# Altium schematic sheet MT8365_Power.SchDoc
size A3; SheetNumber: 3; SheetTotal: 36
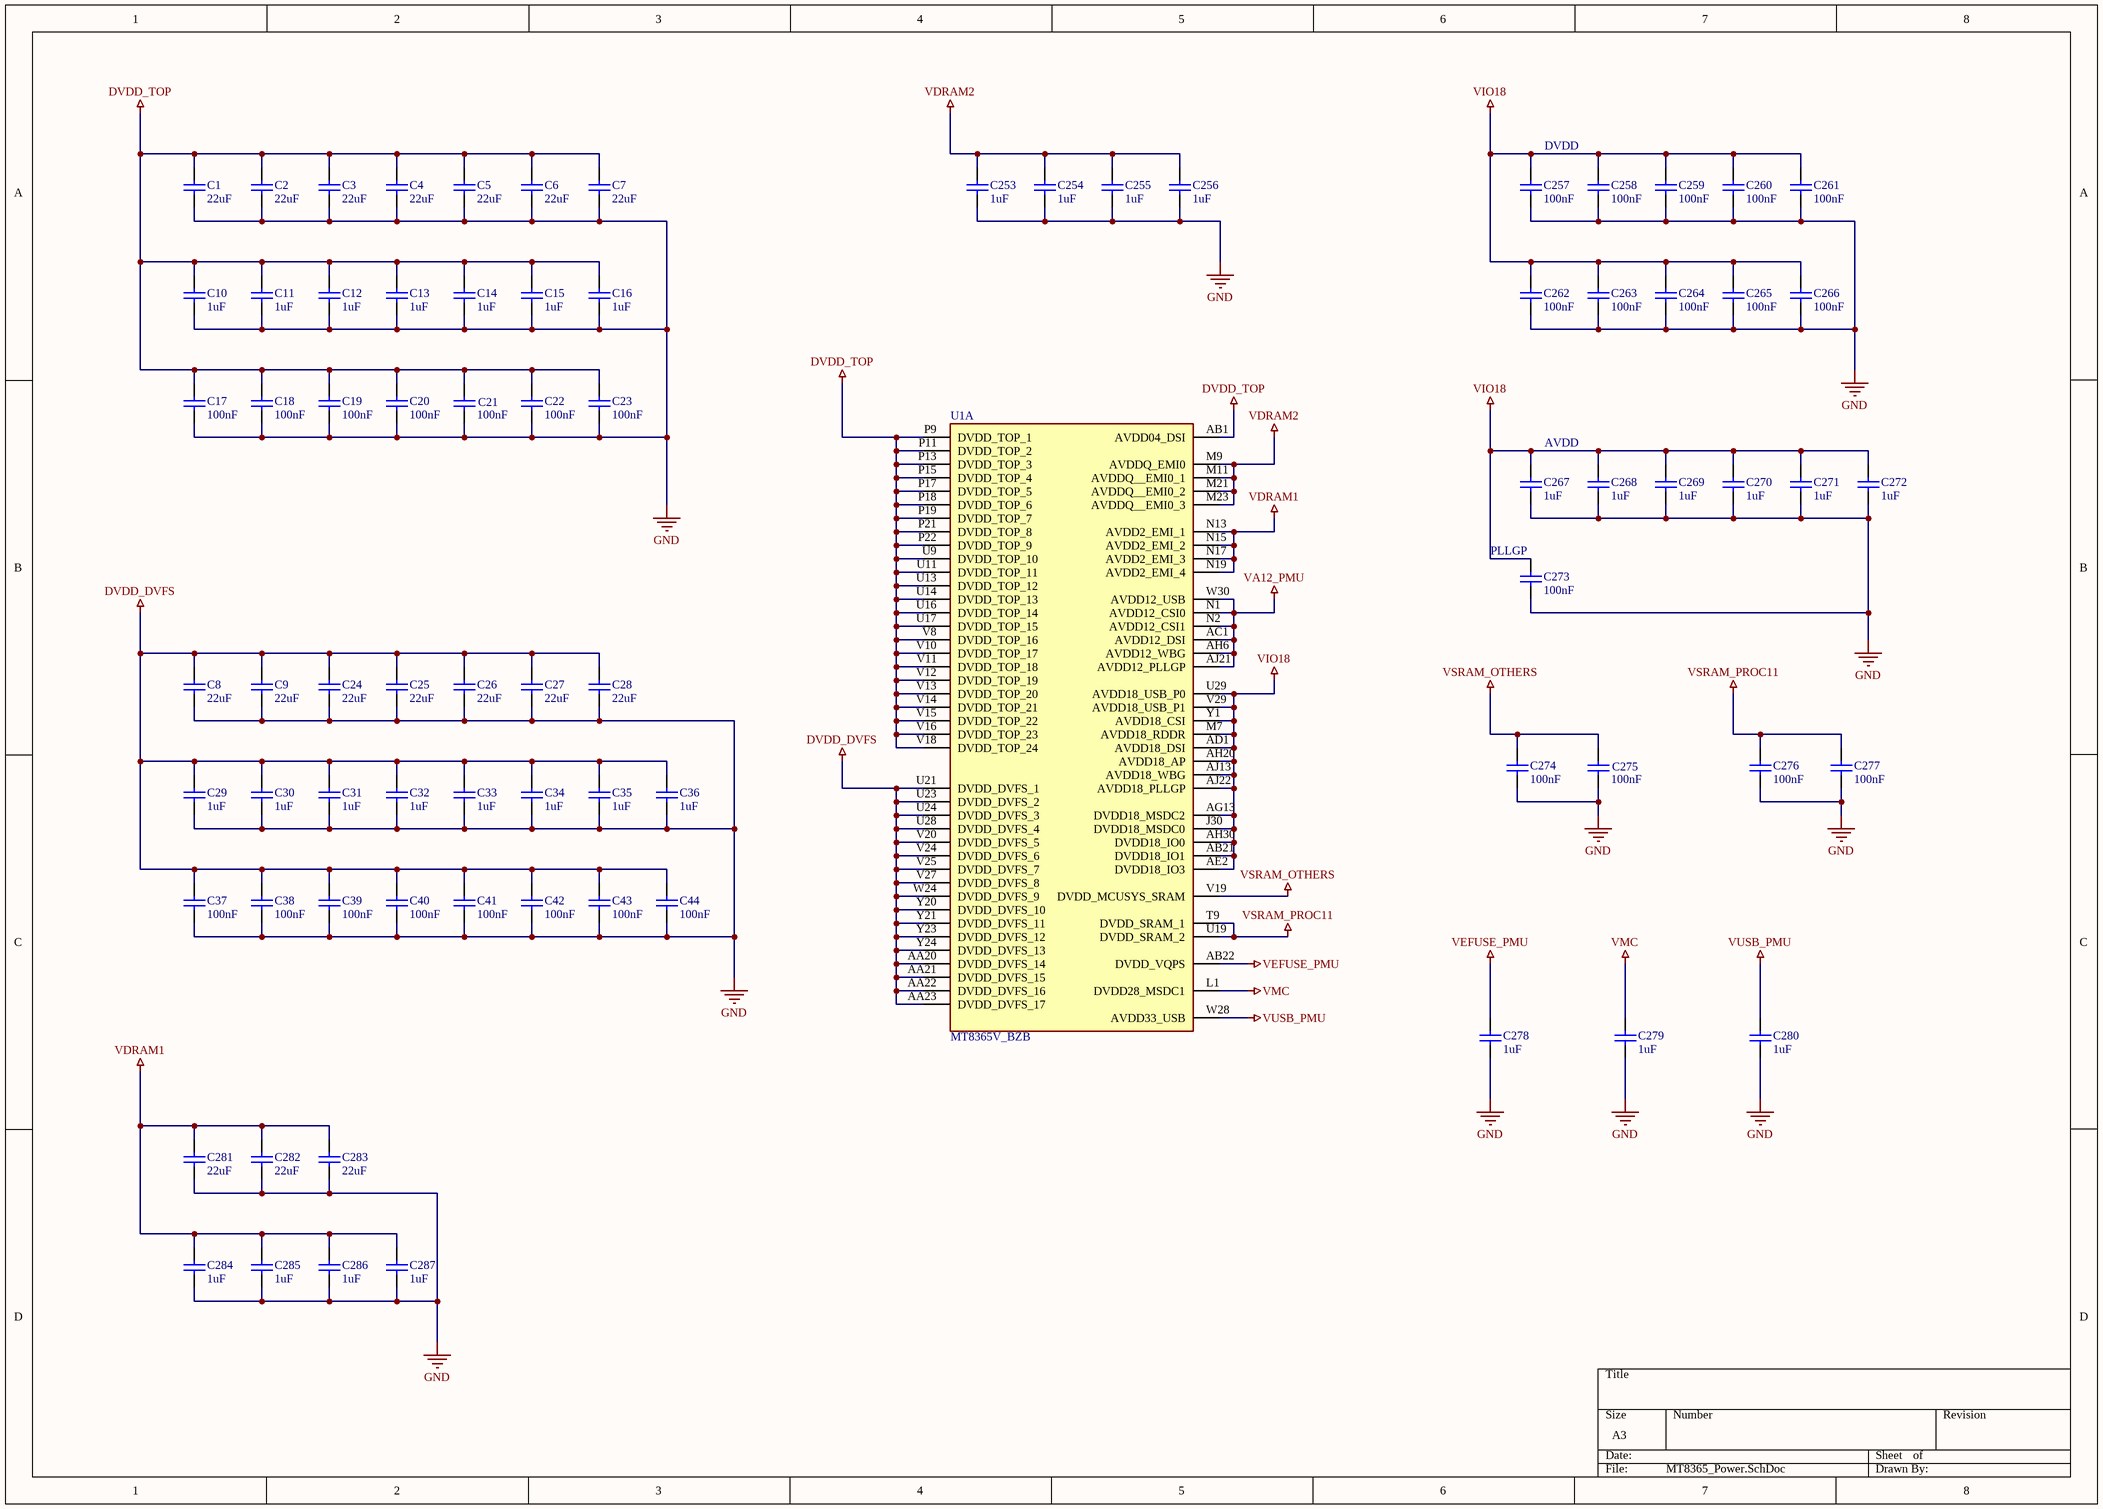
[diagram p0: MT8365_Power.SchDoc]

## Parts
C1  value 22uF  [C1210]  (hidden comment: C1210)
C2  value 22uF  [C1210]  (hidden comment: C1210)
C3  value 22uF  [C1210]  (hidden comment: C1210)
C4  value 22uF  [C1210]  (hidden comment: C1210)
C5  value 22uF  [C1210]  (hidden comment: C1210)
C6  value 22uF  [C1210]  (hidden comment: C1210)
C7  value 22uF  [C1210]  (hidden comment: C1210)
C8  value 22uF  [C1210]  (hidden comment: C1210)
C9  value 22uF  [C1210]  (hidden comment: C1210)
C10  value 1uF  [C0805]  (hidden comment: C0805)
C11  value 1uF  [C0805]  (hidden comment: C0805)
C12  value 1uF  [C0805]  (hidden comment: C0805)
C13  value 1uF  [C0805]  (hidden comment: C0805)
C14  value 1uF  [C0805]  (hidden comment: C0805)
C15  value 1uF  [C0805]  (hidden comment: C0805)
C16  value 1uF  [C0805]  (hidden comment: C0805)
C17  value 100nF  [C0603]  (hidden comment: C0603)
C18  value 100nF  [C0603]  (hidden comment: C0603)
C19  value 100nF  [C0603]  (hidden comment: C0603)
C20  value 100nF  [C0603]  (hidden comment: C0603)
C21  value 100nF  [C0603]  (hidden comment: C0603)
C22  value 100nF  [C0603]  (hidden comment: C0603)
C23  value 100nF  [C0603]  (hidden comment: C0603)
C24  value 22uF  [C1210]  (hidden comment: C1210)
C25  value 22uF  [C1210]  (hidden comment: C1210)
C26  value 22uF  [C1210]  (hidden comment: C1210)
C27  value 22uF  [C1210]  (hidden comment: C1210)
C28  value 22uF  [C1210]  (hidden comment: C1210)
C29  value 1uF  [C0805]  (hidden comment: C0805)
C30  value 1uF  [C0805]  (hidden comment: C0805)
C31  value 1uF  [C0805]  (hidden comment: C0805)
C32  value 1uF  [C0805]  (hidden comment: C0805)
C33  value 1uF  [C0805]  (hidden comment: C0805)
C34  value 1uF  [C0805]  (hidden comment: C0805)
C35  value 1uF  [C0805]  (hidden comment: C0805)
C36  value 1uF  [C0805]  (hidden comment: C0805)
C37  value 100nF  [C0603]  (hidden comment: C0603)
C38  value 100nF  [C0603]  (hidden comment: C0603)
C39  value 100nF  [C0603]  (hidden comment: C0603)
C40  value 100nF  [C0603]  (hidden comment: C0603)
C41  value 100nF  [C0603]  (hidden comment: C0603)
C42  value 100nF  [C0603]  (hidden comment: C0603)
C43  value 100nF  [C0603]  (hidden comment: C0603)
C44  value 100nF  [C0603]  (hidden comment: C0603)
C253  value 1uF  [C0805]  (hidden comment: C0805)
C254  value 1uF  [C0805]  (hidden comment: C0805)
C255  value 1uF  [C0805]  (hidden comment: C0805)
C256  value 1uF  [C0805]  (hidden comment: C0805)
C257  value 100nF  [C0603]  (hidden comment: C0603)
C258  value 100nF  [C0603]  (hidden comment: C0603)
C259  value 100nF  [C0603]  (hidden comment: C0603)
C260  value 100nF  [C0603]  (hidden comment: C0603)
C261  value 100nF  [C0603]  (hidden comment: C0603)
C262  value 100nF  [C0603]  (hidden comment: C0603)
C263  value 100nF  [C0603]  (hidden comment: C0603)
C264  value 100nF  [C0603]  (hidden comment: C0603)
C265  value 100nF  [C0603]  (hidden comment: C0603)
C266  value 100nF  [C0603]  (hidden comment: C0603)
C267  value 1uF  [C0805]  (hidden comment: C0805)
C268  value 1uF  [C0805]  (hidden comment: C0805)
C269  value 1uF  [C0805]  (hidden comment: C0805)
C270  value 1uF  [C0805]  (hidden comment: C0805)
C271  value 1uF  [C0805]  (hidden comment: C0805)
C272  value 1uF  [C0805]  (hidden comment: C0805)
C273  value 100nF  [C0603]  (hidden comment: C0603)
C274  value 100nF  [C0603]  (hidden comment: C0603)
C275  value 100nF  [C0603]  (hidden comment: C0603)
C276  value 100nF  [C0603]  (hidden comment: C0603)
C277  value 100nF  [C0603]  (hidden comment: C0603)
C278  value 1uF  [C0805]  (hidden comment: C0805)
C279  value 1uF  [C0805]  (hidden comment: C0805)
C280  value 1uF  [C0805]  (hidden comment: C0805)
C281  value 22uF  [C1210]  (hidden comment: C1210)
C282  value 22uF  [C1210]  (hidden comment: C1210)
C283  value 22uF  [C1210]  (hidden comment: C1210)
C284  value 1uF  [C0805]  (hidden comment: C0805)
C285  value 1uF  [C0805]  (hidden comment: C0805)
C286  value 1uF  [C0805]  (hidden comment: C0805)
C287  value 1uF  [C0805]  (hidden comment: C0805)
U1  MT8365V_BZB  [BGA633C40P30X29_1220X1180X90]  (part A of 10)

## Nets
DVDD_DVFS: C8.2 C9.2 C24.2 C25.2 C26.2 C27.2 C28.2 C29.2 C30.2 C31.2 C32.2 C33.2 C34.2 C35.2 C36.2 C37.2 C38.2 C39.2 C40.2 C41.2 C42.2 C43.2 C44.2 U1.AA20(DVDD_DVFS_14) U1.AA21(DVDD_DVFS_15) U1.AA22(DVDD_DVFS_16) U1.AA23(DVDD_DVFS_17) U1.U21(DVDD_DVFS_1) U1.U23(DVDD_DVFS_2) U1.U24(DVDD_DVFS_3) U1.U28(DVDD_DVFS_4) U1.V20(DVDD_DVFS_5) U1.V24(DVDD_DVFS_6) U1.V25(DVDD_DVFS_7) U1.V27(DVDD_DVFS_8) U1.W24(DVDD_DVFS_9) U1.Y20(DVDD_DVFS_10) U1.Y21(DVDD_DVFS_11) U1.Y23(DVDD_DVFS_12) U1.Y24(DVDD_DVFS_13)
DVDD_TOP: C1.2 C2.2 C3.2 C4.2 C5.2 C6.2 C7.2 C10.2 C11.2 C12.2 C13.2 C14.2 C15.2 C16.2 C17.2 C18.2 C19.2 C20.2 C21.2 C22.2 C23.2 U1.AB1(AVDD04_DSI) U1.P9(DVDD_TOP_1) U1.P11(DVDD_TOP_2) U1.P13(DVDD_TOP_3) U1.P15(DVDD_TOP_4) U1.P17(DVDD_TOP_5) U1.P18(DVDD_TOP_6) U1.P19(DVDD_TOP_7) U1.P21(DVDD_TOP_8) U1.P22(DVDD_TOP_9) U1.U9(DVDD_TOP_10) U1.U11(DVDD_TOP_11) U1.U13(DVDD_TOP_12) U1.U14(DVDD_TOP_13) U1.U16(DVDD_TOP_14) U1.U17(DVDD_TOP_15) U1.V8(DVDD_TOP_16) U1.V10(DVDD_TOP_17) U1.V11(DVDD_TOP_18) U1.V12(DVDD_TOP_19) U1.V13(DVDD_TOP_20) U1.V14(DVDD_TOP_21) U1.V15(DVDD_TOP_22) U1.V16(DVDD_TOP_23) U1.V18(DVDD_TOP_24)
GND: C1.1 C2.1 C3.1 C4.1 C5.1 C6.1 C7.1 C8.1 C9.1 C10.1 C11.1 C12.1 C13.1 C14.1 C15.1 C16.1 C17.1 C18.1 C19.1 C20.1 C21.1 C22.1 C23.1 C24.1 C25.1 C26.1 C27.1 C28.1 C29.1 C30.1 C31.1 C32.1 C33.1 C34.1 C35.1 C36.1 C37.1 C38.1 C39.1 C40.1 C41.1 C42.1 C43.1 C44.1 C253.1 C254.1 C255.1 C256.1 C257.1 C258.1 C259.1 C260.1 C261.1 C262.1 C263.1 C264.1 C265.1 C266.1 C267.1 C268.1 C269.1 C270.1 C271.1 C272.1 C273.1 C274.1 C275.1 C276.1 C277.1 C278.1 C279.1 C280.1 C281.1 C282.1 C283.1 C284.1 C285.1 C286.1 C287.1
VA12_PMU: U1.AC1(AVDD12_DSI) U1.AH6(AVDD12_WBG) U1.AJ21(AVDD12_PLLGP) U1.N1(AVDD12_CSI0) U1.N2(AVDD12_CSI1) U1.W30(AVDD12_USB)
VDRAM1: C281.2 C282.2 C283.2 C284.2 C285.2 C286.2 C287.2 U1.N13(AVDD2_EMI_1) U1.N15(AVDD2_EMI_2) U1.N17(AVDD2_EMI_3) U1.N19(AVDD2_EMI_4)
VDRAM2: C253.2 C254.2 C255.2 C256.2 U1.M9(AVDDQ_EMI0) U1.M11(AVDDQ__EMI0_1) U1.M21(AVDDQ__EMI0_2) U1.M23(AVDDQ__EMI0_3)
VEFUSE_PMU: C278.2 U1.AB22(DVDD_VQPS)
VIO18: C257.2 C258.2 C259.2 C260.2 C261.2 C262.2 C263.2 C264.2 C265.2 C266.2 C267.2 C268.2 C269.2 C270.2 C271.2 C272.2 C273.2 U1.AB21(DVDD18_IO1) U1.AD1(AVDD18_DSI) U1.AE2(DVDD18_IO3) U1.AG13(DVDD18_MSDC2) U1.AH20(AVDD18_AP) U1.AH30(DVDD18_IO0) U1.AJ13(AVDD18_WBG) U1.AJ22(AVDD18_PLLGP) U1.J30(DVDD18_MSDC0) U1.M7(AVDD18_RDDR) U1.U29(AVDD18_USB_P0) U1.V29(AVDD18_USB_P1) U1.Y1(AVDD18_CSI)
VMC: C279.2 U1.L1(DVDD28_MSDC1)
VSRAM_OTHERS: C274.2 C275.2 U1.V19(DVDD_MCUSYS_SRAM)
VSRAM_PROC11: C276.2 C277.2 U1.T9(DVDD_SRAM_1) U1.U19(DVDD_SRAM_2)
VUSB_PMU: C280.2 U1.W28(AVDD33_USB)

## Notes on the sheet
- DVDD
- AVDD
- (near C273) PLLGP

## Library data of the parts
U1 = MT8365V_BZB: SoC; Manufacturer_Name: Mediatek; Manufacturer_Part_Number: MT8365V/BZB; Datasheet Link: https://www.mouser.co.uk/datasheet/2/1074/MT8365_AIoT_Application_Processor_Datasheet_v1_0_2-3106631.pdf; Height: 0.9mm; Mouser Part Number: 840-MT8365V/BZB; Mouser Price/Stock: https://www.mouser.co.uk/ProductDetail/MediaTek/MT8365V-BZB?qs=Jm2GQyTW%2FbjcedX9ugwNWQ%3D%3D